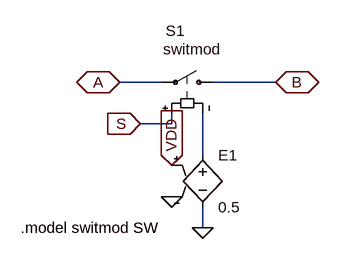
[diagram p0: schematic Ideal_SW.asc]
Ideal_SW.asc, the LTspice schematic file:
Version 4
SHEET 1 880 680
WIRE 144 176 80 176
WIRE 320 176 224 176
WIRE 160 240 160 224
WIRE 160 240 112 240
WIRE 208 288 208 224
WIRE 208 400 208 368
FLAG 208 400 0
FLAG 160 352 0
FLAG 160 304 VDD
IOPIN 160 304 In
FLAG 80 176 A
IOPIN 80 176 BiDir
FLAG 320 176 B
IOPIN 320 176 BiDir
FLAG 112 240 S
IOPIN 112 240 In
SYMBOL sw 240 176 M270
WINDOW 3 24 -12 Left 0
WINDOW 38 51 93 VLeft 0
WINDOW 0 79 89 VLeft 0
SYMATTR Value ""
SYMATTR SpiceModel switmod
SYMATTR InstName S1
SYMBOL e 208 272 R0
SYMATTR InstName E1
SYMATTR Value 0.5
TEXT -72 400 Left 0 !.model switmod SW

The netlist it stands for:
* Ideal_SW.asc
S1 B A S N001 switmod
E1 N001 0 VDD 0 0.5
.model switmod SW
.backanno
.end